# EAGLE design KGGR_MV (EAGLE 9.4.2)
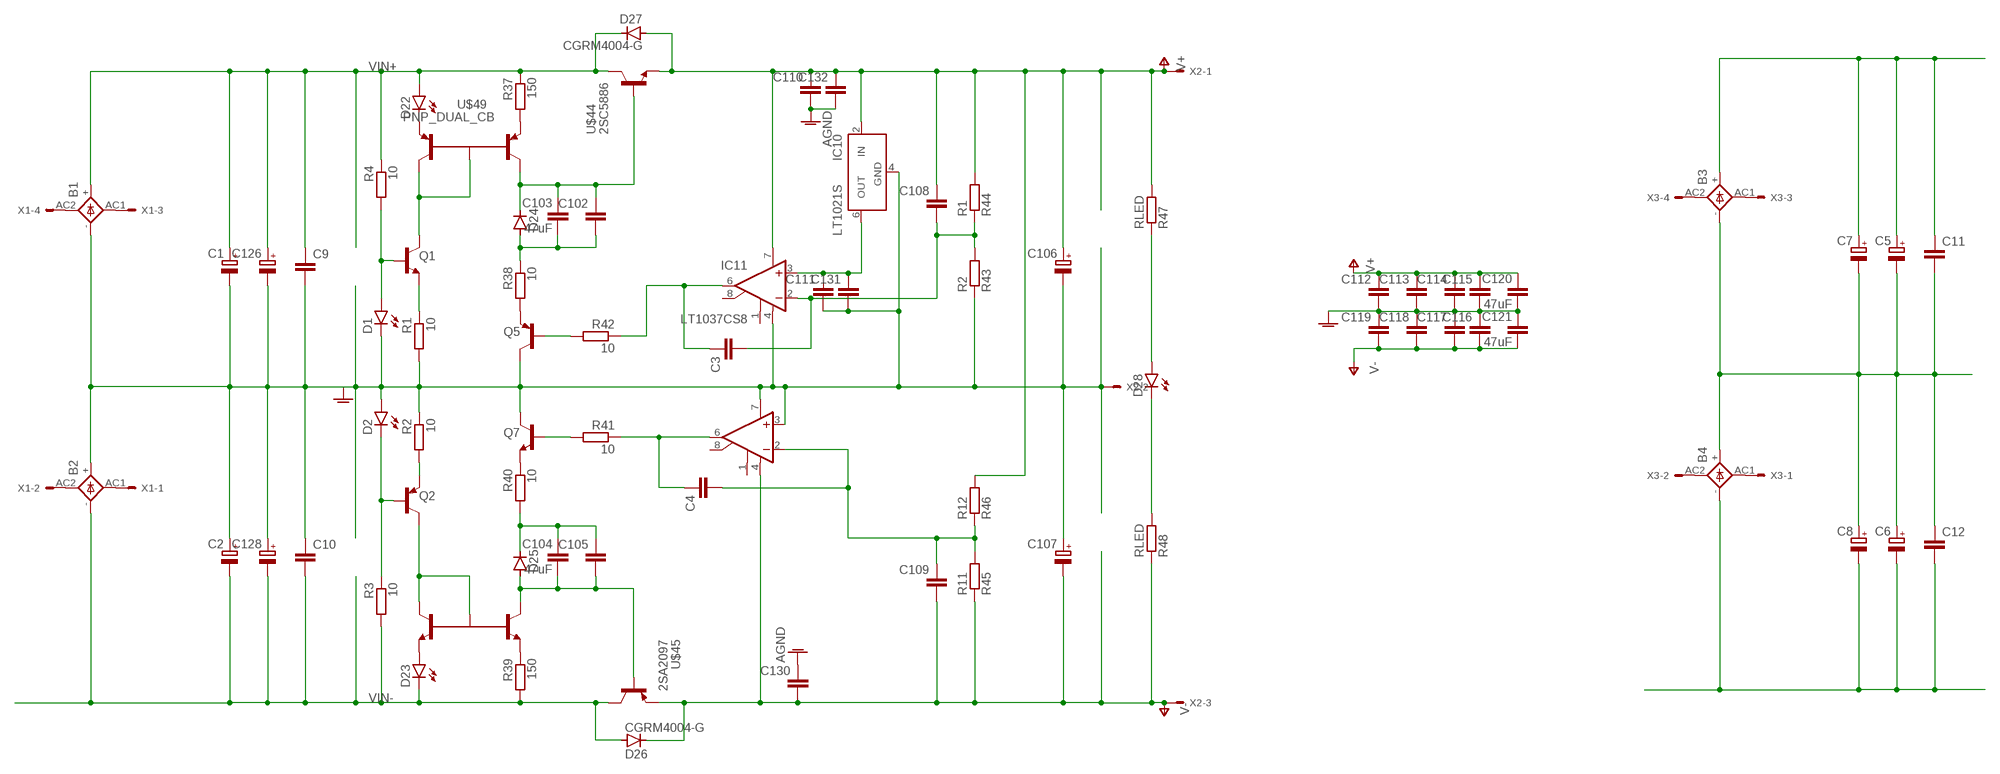
[diagram p0: schematic, sheet 1]

## Parts
B1  GBU4  [GBU4S]
B2  GBU4  [GBU4S]
B3  GBU4  [GBU4S]
B4  GBU4  [GBU4S]
C1  CPOL-EUE7.5-18  [E7,5-18]
C2  CPOL-EUE7.5-18  [E7,5-18]
C3  C-EUC0805  [C0805]
C4  C-EUC0805  [C0805]
C5  CPOL-EUE10-35  [EB35D]
C6  CPOL-EUE10-35  [EB35D]
C7  CPOL-EUE10-35  [EB35D]
C8  CPOL-EUE10-35  [EB35D]
C9  C-EU050-050X075  [C050-050X075]
C10  C-EU050-050X075  [C050-050X075]
C11  C-EU050-050X075  [C050-050X075]
C12  C-EU050-050X075  [C050-050X075]
C102  C-EUC0805  [C0805]
C103  47uF  C-EUC1206  [C1206]
C104  47uF  C-EUC1206  [C1206]
C105  C-EUC0805  [C0805]
C106  CPOL-EUE5-10.5  [E5-10,5]
C107  CPOL-EUE5-10.5  [E5-10,5]
C108  C-EUC0805  [C0805]
C109  C-EUC0805  [C0805]
C110  C-EUC0805  [C0805]
C111  C-EUC0805  [C0805]
C112  C-EUC0805  [C0805]
C113  C-EUC0805  [C0805]
C114  C-EUC0805  [C0805]
C115  C-EUC0805  [C0805]
C116  C-EUC0805  [C0805]
C117  C-EUC0805  [C0805]
C118  C-EUC0805  [C0805]
C119  C-EUC0805  [C0805]
C120  47uF  C-EUC1206  [C1206]
C121  47uF  C-EUC1206  [C1206]
C126  CPOL-EUE7.5-18  [E7,5-18]
C128  CPOL-EUE7.5-18  [E7,5-18]
C130  C-EUC0805  [C0805]
C131  C-EUC0805  [C0805]
C132  C-EUC0805  [C0805]
D1  LEDVWV1206  [LED_SML1206]
D2  LEDVWV1206  [LED_SML1206]
D22  LEDVWV1206  [LED_SML1206]
D23  LEDVWV1206  [LED_SML1206]
D24  TZMC10  DIODE-SOD80C  [SOD80C]
D25  TZAMC10  DIODE-SOD80C  [SOD80C]
D26  CGRM4004-G  [SOD-123_MINI-SMA]
D27  CGRM4004-G  [SOD-123_MINI-SMA]
D28  LEDVWV1206  [LED_SML1206]
IC10  LT1021S  [SOIC8]
IC11  LT1037CS8  [SOIC8]
IC12  LT1037CS8  [SOIC8]
Q1  TRANSISTOR_BC847CLT1-NPN-SOT23-BEC  [TRANSISTOR_SOT23-BEC]
Q2  TRANSISTOR_BC857C-PNP-SOT23-BEC  [TRANSISTOR_SOT23-BEC]
Q5  TRANSISTOR_BC857C-PNP-SOT23-BEC  [TRANSISTOR_SOT23-BEC]
Q7  TRANSISTOR_BC847CLT1-NPN-SOT23-BEC  [TRANSISTOR_SOT23-BEC]
R1  10  R-EU_MELF0204W  [MINI_MELF-0204W]
R2  10  R-EU_MELF0204W  [MINI_MELF-0204W]
R3  10  R-EU_MELF0204W  [MINI_MELF-0204W]
R4  10  R-EU_MELF0204W  [MINI_MELF-0204W]
R37  150  R-EU_MELF0204W  [MINI_MELF-0204W]
R38  10  R-EU_MELF0204W  [MINI_MELF-0204W]
R39  150  R-EU_MELF0204W  [MINI_MELF-0204W]
R40  10  R-EU_MELF0204W  [MINI_MELF-0204W]
R41  10  R-EU_MELF0204W  [MINI_MELF-0204W]
R42  10  R-EU_MELF0204W  [MINI_MELF-0204W]
R43  R2  R-EU_MELF0204W  [MINI_MELF-0204W]
R44  R1  R-EU_MELF0204W  [MINI_MELF-0204W]
R45  R11  R-EU_MELF0204W  [MINI_MELF-0204W]
R46  R12  R-EU_MELF0204W  [MINI_MELF-0204W]
R47  RLED  R-EU_MELF0204W  [MINI_MELF-0204W]
R48  RLED  R-EU_MELF0204W  [MINI_MELF-0204W]
U$44  2SC5886  [NEW-PWMOLD]
U$45  2SA2097  [NEW-PWMOLD]
U$48  NPN_DUAL_CBSOT-25-5  [SOT25]
U$49  PNP_DUAL_CB  [SOT25]
X1  KK-156-4  [KK-156-4]
X2  KK-156-3  [KK-156-3]
X3  KK-156-4  [KK-156-4]

## Nets
AGND: B1.- B2.+ C1.- C2.+ C9.2 C10.1 C106.- C107.+ C110.2 C111.2 C112.2 C113.2 C114.2 C115.2 C116.1 C117.1 C118.1 C119.1 C120.2 C121.1 C126.- C128.+ C130.1 C131.2 C132.2 D1.C D2.A IC10.4(GND) IC11.4(V-) IC12.3(+IN) IC12.7(V+) Q5.C Q7.C R1.2 R2.1 R43.1 X2.2
AGND1: B3.- B4.+ C5.- C6.+ C7.- C8.+ C11.2 C12.1
N$1: B1.AC2(AC1) X1.4
N$2: B1.AC1(AC2) X1.3
N$3: B2.AC2(AC1) X1.2
N$4: B2.AC1(AC2) X1.1
N$5: B3.AC2(AC1) X3.4
N$6: B3.AC1(AC2) X3.3
N$7: B4.AC2(AC1) X3.2
N$8: B4.AC1(AC2) X3.1
N$9: Q1.E R1.1
N$10: D1.A Q1.B R4.2
N$12: Q2.E R2.2
N$13: D2.C Q2.B R3.1
N$96: Q1.C U$49.2(B) U$49.5(C1)
N$97: C102.1 C103.1 D24.C U$44.1(B) U$49.4(C2)
N$98: C102.2 C103.2 D24.A R38.1
N$99: Q5.E R38.2
N$100: Q7.E R40.1
N$101: C104.1 C105.1 D25.C R40.2
N$102: C104.2 C105.2 D25.A U$45.1(B) U$48.4(C2)
N$103: Q2.C U$48.2(B) U$48.5(C1)
N$104: Q7.B R41.2
N$105: Q5.B R42.2
N$106: C3.2 C108.2 IC11.2(-IN) R43.2 R44.1
N$107: D28.C R48.2
N$108: D28.A R47.1
N$109: C4.1 IC12.6(OUT) R41.1
N$110: C4.2 C109.1 IC12.2(-IN) R45.2 R46.1
N$111: C111.1 C131.1 IC10.6(OUT) IC11.3(+IN)
N$112: C3.1 IC11.6(OUT) R42.1
N$113: R39.1 U$48.3(E2)
N$114: D23.A U$48.1(E1)
N$115: R37.2 U$49.3(E2)
N$116: D22.C U$49.1(E1)
V+: C106.+ C108.1 C110.1 C112.1 C113.1 C114.1 C115.1 C120.1 C132.1 D27.A IC10.2(IN) IC11.7(V+) R44.2 R46.2 R47.2 U$44.3(E) X2.1
V-: C107.- C109.2 C116.2 C117.2 C118.2 C119.2 C121.2 C130.2 D26.C IC12.4(V-) R45.1 R48.1 U$45.3(E) X2.3
VIN+: B1.+ C1.+ C9.1 C126.+ D22.A D27.C R4.1 R37.1 U$44.2(C) U$44.4(C) U$44.P$1(C) U$44.P$2(C) U$44.P$3(C) U$44.P$4(C) U$44.P$5(C) U$44.P$6(C) U$44.P$7(C) U$44.P$8(C) U$44.P$9(C) U$44.P$10(C) U$44.P$11(C) U$44.P$12(C) U$44.P$13(C) U$44.P$14(C) U$44.P$15(C) U$44.P$16(C) U$44.P$17(C) U$44.P$18(C) U$44.P$19(C) U$44.P$20(C) U$44.P$21(C) U$44.P$22(C) U$44.P$23(C) U$44.P$24(C) U$44.P$25(C) U$44.P$26(C) U$44.P$27(C) U$44.P$28(C) U$44.P$29(C) U$44.P$30(C) U$44.P$31(C) U$44.P$32(C) U$44.P$33(C) U$44.P$34(C) U$44.P$35(C) U$44.P$36(C) U$44.P$37(C) U$44.P$38(C) U$44.P$39(C) U$44.P$40(C) U$44.P$41(C) U$44.P$42(C) U$44.P$43(C) U$44.P$44(C) U$44.P$45(C) U$44.P$46(C) U$44.P$47(C) U$44.P$48(C) U$44.P$49(C) U$44.P$50(C) U$44.P$51(C) U$44.P$52(C) U$44.P$53(C) U$44.P$54(C) U$44.P$55(C) U$44.P$56(C) U$44.P$57(C) U$44.P$58(C) U$44.P$59(C) U$44.P$60(C) U$44.P$61(C) U$44.P$62(C) U$44.P$63(C)
VIN+1: B3.+ C5.+ C7.+ C11.1
VIN-: B2.- C2.- C10.2 C128.- D23.C D26.A R3.2 R39.2 U$45.2(C) U$45.4(C) U$45.P$1(C) U$45.P$2(C) U$45.P$3(C) U$45.P$4(C) U$45.P$5(C) U$45.P$6(C) U$45.P$7(C) U$45.P$8(C) U$45.P$9(C) U$45.P$10(C) U$45.P$11(C) U$45.P$12(C) U$45.P$13(C) U$45.P$14(C) U$45.P$15(C) U$45.P$16(C) U$45.P$17(C) U$45.P$18(C) U$45.P$19(C) U$45.P$20(C) U$45.P$21(C) U$45.P$22(C) U$45.P$23(C) U$45.P$24(C) U$45.P$25(C) U$45.P$26(C) U$45.P$27(C) U$45.P$28(C) U$45.P$29(C) U$45.P$30(C) U$45.P$31(C) U$45.P$32(C) U$45.P$33(C) U$45.P$34(C) U$45.P$35(C) U$45.P$36(C) U$45.P$37(C) U$45.P$38(C) U$45.P$39(C) U$45.P$40(C) U$45.P$41(C) U$45.P$42(C) U$45.P$43(C) U$45.P$44(C) U$45.P$45(C) U$45.P$46(C) U$45.P$47(C) U$45.P$48(C) U$45.P$49(C) U$45.P$50(C) U$45.P$51(C) U$45.P$52(C) U$45.P$53(C) U$45.P$54(C) U$45.P$55(C) U$45.P$56(C) U$45.P$57(C) U$45.P$58(C) U$45.P$59(C) U$45.P$60(C) U$45.P$61(C) U$45.P$62(C) U$45.P$63(C)
VIN-1: B4.- C6.- C8.- C12.2
Unconnected: IC11.1(CMP1) IC11.8(CMP2) IC12.1(CMP1) IC12.8(CMP2)

## Library data of the parts
B1-B4 = Vwvwbg:GBU4: GENERAL INSTRUMENT RECTIFIER
C1 C2 C5-C8 C106 C107 C126 C128 = Vwvwbg:CPOL-EU: POLARIZED CAPACITOR, European symbol
C3 C4 C9-C12 C102-C105 C108-C121 C130-C132 = Vwvwbg:C-EU: CAPACITOR, European symbol
D1 D2 D22 D23 D28 = Vwvwbg:LED: LED OSRAM: - CHIPLED LG R971, LG N971, LY N971, LG Q971, LY Q971, LO R971, LY R971 LH N974, LH R974 LS Q976, LO Q976, LY Q976 LO Q996 - Hyper CHIPLED LW Q18S LB Q993, LB Q99A, LB R99A - SideLED LS A670, LO A670, LY A670, LG A670, LP A670 LB A673, LV A673, LT A673, LW A673 LH A674 LY A675 LS A676, LA A676, LO A676, LY A676, LW A676 LS A679, LY A679, LG A679 - Hyper Micro SIDELED® LS Y876, LA Y876, LO Y876, LY Y876 LT Y87S - SmartLED LW L88C, LW L88S LB L89C, LB L89S, LG L890 LS L89K, LO L89K, LY L89K LS L896, LA L896, LO L896, LY L896 - TOPLED LS T670, LO T670, LY T670, LG T670, LP T670 LSG T670, LSP T670, LSY T670, LOP T670, LYG T670 LG T671, LOG T671, LSG T671 LB T673, LV T673, LT T673, LW T673 LH T674 LS T676, LA T676, LO T676, LY T676, LB T676, LH T676, LSB T676, LW T676 LB T67C, LV T67C, LT T67C, LS T67K, LO T67K, LY T67K, LW E67C LS E67B, LA E67B, LO E67B, LY E67B, LB E67C, LV E67C, LT E67C LW T67C LS T679, LY T679, LG T679 LS T770, LO T770, LY T770, LG T770, LP T770 LB T773, LV T773, LT T773, LW T773 LH T774 LS E675, LA E675, LY E675, LS T675 LS T776, LA T776, LO T776, LY T776, LB T776 LHGB T686 LT T68C, LB T68C - Hyper Mini TOPLED® LB M676 - Mini TOPLED Santana® LG M470 LS M47K, LO M47K, LY M47K Source: http://www.osram.convergy.de LUXEON: - LUMILED® LXK2-PW12-R00, LXK2-PW12-S00, LXK2-PW14-U00, LXK2-PW14-V00 LXK2-PM12-R00, LXK2-PM12-S00, LXK2-PM14-U00 LXK2-PE12-Q00, LXK2-PE12-R00, LXK2-PE12-S00, LXK2-PE14-T00, LXK2-PE14-U00 LXK2-PB12-K00, LXK2-PB12-L00, LXK2-PB12-M00, LXK2-PB14-N00, LXK2-PB14-P00, LXK2-PB14-Q00 LXK2-PR12-L00, LXK2-PR12-M00, LXK2-PR14-Q00, LXK2-PR14-R00 LXK2-PD12-Q00, LXK2-PD12-R00, LXK2-PD12-S00 LXK2-PH12-R00, LXK2-PH12-S00 LXK2-PL12-P00, LXK2-PL12-Q00, LXK2-PL12-R00 Source: www.luxeon.com KINGBRIGHT: KA-3528ASYC Source: www.kingbright.com
D24 D25 = Vwvwbg:DIODE-: DIODE
D26 D27 = diode:CGRM400*-G: Molded plasitc,JEDEC SOD-123/Mini SMA Source: Comchip CGRM4001-G.pdf
IC10 = Vwvwbg:LT1021: Precision Reference Source: http://www.linear.com/pc/downloadDocument.do?navId=H0,C1,C1010,C1603,P1229,D2805; MPN: LT1021DCS8-10#PBF; OC_FARNELL: 1273428; OC_NEWARK: 57M0993
IC11 IC12 = Vwvwbg:LT10*: Low Noise, High Speed, Precision Operational Amplifiers Source: http://www.linear.com/pc/downloadDocument.do?navId=H0,C1,C1154,C1009,C1026,P1212,D2204
Q1 Q7 = Vwvwbg:TRANSISTOR_*-NPN-: NPN Transistror BF959 corrected 2008.03.06
Q2 Q5 = Vwvwbg:TRANSISTOR_*-PNP-: PNP Transistror
R1-R4 R37-R48 = Vwvwbg:R-EU_: RESISTOR, European symbol
U$44 = Vwvwbg:2SC5886
U$45 = Vwvwbg:2SA2097
U$48 = Vwvwbg:NPN_DUAL_CB
U$49 = Vwvwbg:PNP_DUAL_CB
X1 X3 = Vwvwbg:KK-156-4: KK 156 HEADER Source: http://www.molex.com/pdm_docs/sd/026604100_sd.pdf; MF: MOLEX; OC_FARNELL: unknown; OC_NEWARK: unknown
X2 = Vwvwbg:KK-156-3: KK 156 HEADER Source: http://www.molex.com/pdm_docs/sd/026604100_sd.pdf; MF: MOLEX; OC_FARNELL: unknown; OC_NEWARK: unknown

## Board
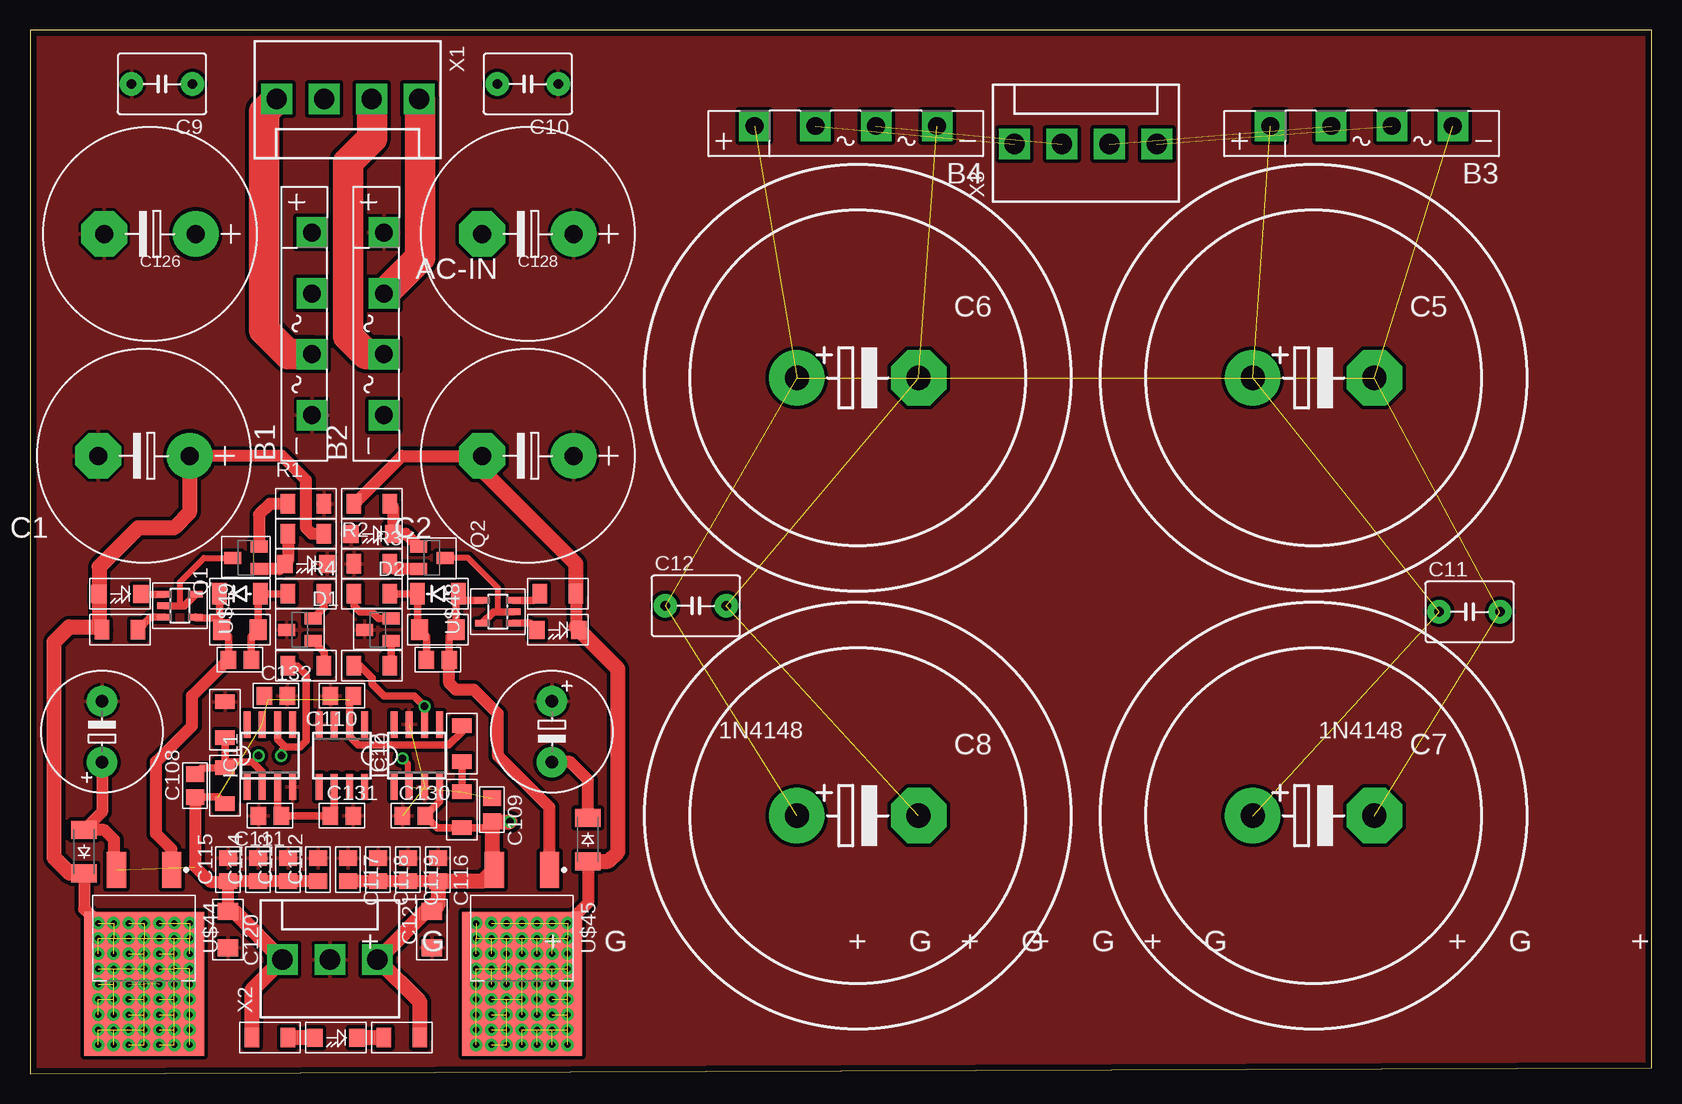
[diagram p1: board, top side]
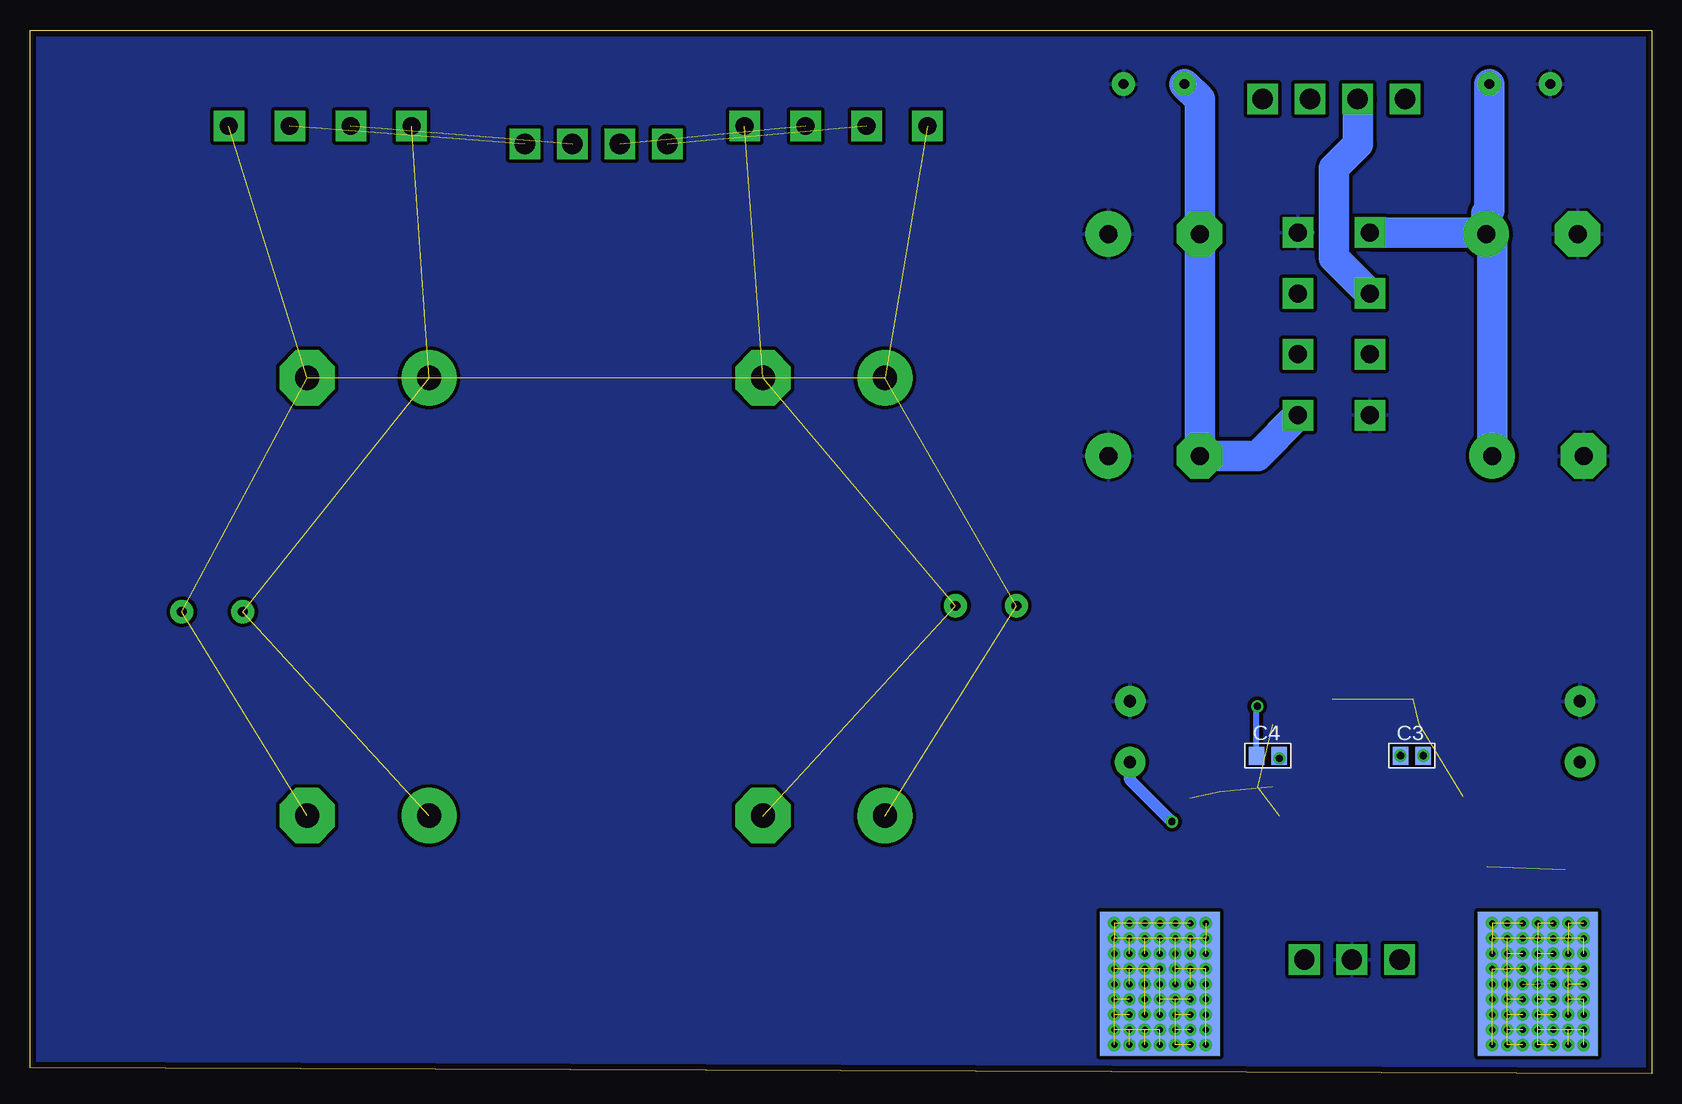
[diagram p2: board, bottom side, seen from below]

Size 135.19 x 87 mm. Coordinates in mm from the lower left corner, seen from the top.
Outline: 0,0 135.19,0.5 135.19,87 0,87 0,0
Copper layers (1*16): Top 0.035mm / dielectric 1.5mm / Bottom 0.035mm
Design rules "default *": minimum track width 10mil, minimum drill 24mil, track to track 12mil, track to pad 12mil, pad to pad 8mil, via to via 8mil, smd to smd 8mil, copper to edge 20mil, drill to drill 8mil, minimum pad ring 10mil, minimum via ring 8mil, stop-mask expansion 4mil, vias tented up to drill 0mil, thermal gap 10mil

### Footprints (pad centres in the part's own frame; a part is rotated, then mirrored left to right if it is on the bottom)
GBU4S = drill 1.499 pad 2.54 square: + 7.62,0; - -7.62,0; AC1 2.54,0; AC2 -2.54,0
E7,5-18 = drill 1.5 pad 3.81: + -3.81,0 | drill 1.5 pad 3.81 octagon: - 3.81,0
C0805 = smd 1.3 x 1.5: 1 -0.95,0; 2 0.95,0
EB35D = drill 2.007 pad 4.597: + -5.08,0 | drill 2.007 pad 4.597 octagon: - 5.08,0
C050-050X075 = drill 0.813 pad 1.93: 1 -2.54,0; 2 2.54,0
C1206 = smd 1.4 x 1.7: 1 -1.527,0; 2 1.527,0
E5-10,5 = drill 1.016 pad 2.54: + -2.54,0; - 2.54,0
LED_SML1206 = smd 1.3 x 1.5: A 1.75,0; C -1.75,0
SOD80C = smd 1.2 x 1.8: A 1.7,0; C -1.7,0
SOD-123_MINI-SMA = smd 1.5 x 2.1: A 1.8,0; C -1.8,0
SOIC8 = smd 0.6 x 2.2: 1 -1.905,-2.6; 2 -0.635,-2.6; 3 0.635,-2.6; 4 1.905,-2.6; 5 1.905,2.6; 6 0.635,2.6; 7 -0.635,2.6; 8 -1.905,2.6
TRANSISTOR_SOT23-BEC = smd 1 x 1.4: B -0.95,-1.1; C 0,1.1; E 0.95,-1.1
MINI_MELF-0204W = smd 1.2 x 1.6: 1 -1.5,0; 2 1.5,0
NEW-PWMOLD = smd 3 x 1.6: 1 0.003,2.3; 3 0.003,-2.3 | smd 12 x 10 bottom: 2 9.5,0 | smd 12 x 10: 4 9.5,0 | drill 0.5 pad 1.016: P$1 5.734,2.54; P$2 7.004,2.54; P$3 8.274,2.54; P$4 9.544,2.54; P$5 10.814,2.54; P$6 12.084,2.54; P$7 13.354,2.54; P$8 13.354,1.27; P$9 12.084,1.27; P$10 9.544,1.27; P$11 10.814,1.27; P$12 8.274,1.27; P$13 7.004,1.27; P$14 5.734,1.27; P$15 5.734,0; P$16 7.004,0; P$17 8.274,0; P$18 9.544,0; P$19 10.814,0; P$20 12.084,0; P$21 13.354,0; P$22 13.354,-1.27; P$23 12.084,-1.27; P$24 10.814,-1.27; P$25 9.544,-1.27; P$26 8.274,-1.27; P$27 7.004,-1.27; P$28 5.734,-1.27; P$29 5.734,-2.54; P$30 7.004,-2.54; P$31 8.274,-2.54; P$32 9.544,-2.54; P$33 10.814,-2.54; P$34 12.084,-2.54; P$35 13.354,-2.54; P$36 13.354,-3.81; P$37 12.084,-3.81; P$38 10.814,-3.81; P$39 9.544,-3.81; P$40 7.004,-3.81; P$41 5.734,-3.81; P$42 8.274,-3.81; P$43 5.734,3.81; P$44 7.004,3.81; P$45 8.274,3.81; P$46 9.544,3.81; P$47 10.814,3.81; P$48 12.084,3.81; P$49 13.354,3.81; P$50 14.624,3.81; P$51 14.624,2.54; P$52 14.624,1.27; P$53 14.624,0; P$54 14.624,-1.27; P$55 14.624,-2.54; P$56 14.624,-3.81; P$57 4.464,3.81; P$58 4.464,2.54; P$59 4.464,1.27; P$60 4.464,0; P$61 4.464,-1.27; P$62 4.464,-2.54; P$63 4.464,-3.81
SOT25 = smd 0.55 x 1.2: 1 -0.95,-1.3; 2 0,-1.3; 3 0.95,-1.3; 4 0.95,1.3; 5 -0.95,1.3
KK-156-4 = drill 1.7 pad 2.54 square: 1 -5.94,0; 2 -1.98,0; 3 1.98,0; 4 5.94,0
KK-156-3 = drill 1.7 pad 2.54 square: 1 -3.96,0; 2 0,0; 3 3.96,0

### Placement (x,y rotation side)
B1  23.5,62.5 90 top
B2  29.5,62.5 90 top
B3  111,79 180 top
B4  68,79 180 top
C1  9.5,51.5 180 top
C2  41.5,51.5 180 top
C3  20,26.5 0 bottom
C4  32,26.5 0 bottom
C5  107,58 0 top
C6  69,58 0 top
C7  107,21.5 0 top
C8  69,21.5 0 top
C9  11,82.5 180 top
C10  41.5,82.5 180 top
C11  120,38.5 0 top
C12  55.5,39 0 top
C102  17.5,34.5 0 top
C103  17.5,37 0 top
C104  34,37 0 top
C105  34,34.5 0 top
C106  6,28.5 90 top
C107  43.5,28.5 270 top
C108  13.75,24 90 top
C109  38.5,22 270 top
C110  26,31.5 180 top
C111  20,21.5 180 top
C112  24,17 90 top
C113  21.5,17 90 top
C114  19,17 90 top
C115  16.5,17 90 top
C116  34,17 270 top
C117  26.5,17 270 top
C118  29,17 270 top
C119  31.5,17 270 top
C120  16.5,12 270 top
C121  33.5,12 90 top
C126  10,70 180 top
C128  41.5,70 180 top
C130  32,21.5 0 top
C131  26,21.5 0 top
C132  20.5,31.5 0 top
D1  23,42.5 180 top
D2  28.5,45 180 top
D22  7.5,40 180 top
D23  44,37 180 top
D24  17.5,40 0 top
D25  34,40 0 top
D26  46.5,19.5 270 top
D27  4.5,18.5 90 top
D28  25.5,3 180 top
IC10  26,26.5 180 top
IC11  20,26.5 0 top
IC12  32.25,26.5 0 top
Q1  18,43 90 top
Q2  33.5,43 270 top
Q5  22.5,37 90 top
Q7  29,37 90 top
R1  23,47.5 0 top
R2  28.5,42.5 0 top
R3  28.5,47.5 180 top
R4  23,45 180 top
R37  7.5,37 0 top
R38  23,40 0 top
R39  44,40 0 top
R40  28.5,40 0 top
R41  28.5,34 0 top
R42  23,34 0 top
R43  16.25,29.5 270 top
R44  16.25,24 270 top
R45  36,22 90 top
R46  36,27.5 90 top
R47  20,3 180 top
R48  31,3 180 top
U$44  9.5,17 270 top
U$45  41,17 270 top
U$48  39,38.5 90 top
U$49  12.5,39 270 top
X1  26.5,81.25 180 top
X2  25,9.5 0 top
X3  88,77.5 0 top

### Tracks (layer width: path | path; a pad name or v marks a point on that pad's centre or on a via)
AGND  (2 unrouted)
  pour Top: -3,106.68 152.88,106.68 152.88,-1.27 -3,-1.27
  pour Bottom: -2.5,-1.27 -2.5,106.18 152.88,106.18 152.88,-1.27
AGND1  (7 unrouted)
N$1
  Top 2.54: B1.AC2 23.46,60 21.5,60 19.5,62 19.5,80.19 X1.4
N$2
  Bottom 2.54: B1.AC1 26.5,68.04 26.5,75.5 24.5,77.5 24.5,81.23 X1.3
N$3
  Top 2.54: B2.AC2 28.04,59.96 26.5,61.5 26.5,76 28.5,78 28.5,81.23 X1.2
N$4
  Top 2.54: B2.AC1 32.5,68.04 32.5,81.19 X1.1
N$5  (1 unrouted)
N$6  (1 unrouted)
N$7  (1 unrouted)
N$8  (1 unrouted)
N$9
  Top 1.016: R1.1 20,47.5 19.1,46.6 Q1.E
N$10
  Top 1.016: R4.2 21.5,42.75 D1.A 20.8,42.05 Q1.B
N$12
  Top 1.016: Q2.E 30.45,42.05 R2.2
N$13
  Top 1.016: R3.1 30.25,47.25 D2.C 31.35,45 Q2.B
N$96
  Top 0.508: 12.5,39 12.5,41 14.5,43 Q1.C
  Top 0.61: U$49.5 12.85,39 12.5,39 U$49.2
N$97
  Top 0.61: C102.1 16.55,36.42 C103.1 15.8,37.17 15.8,38 | D24.C 15.8,38 | U$49.4 13.85,38 15.8,38
  Top 1.016: U$44.1 11.8,18.7 10.5,20 10.5,26 13.5,29 13.5,31.5 16.5,34.5 C102.1
N$98
  Top 0.61: R38.1 D24.A 19.03,39.83 C103.2 18.45,36.42 C102.2
N$99
  Top 0.61: R38.2 24.5,38.85 Q5.E
N$100
  Top 0.61: Q7.E 29.05,37.95 28.5,38.5 27.5,38.5 27,39 R40.1
N$101
  Top 0.61: R40.2 D25.C 32.3,37.17 C104.1 33.05,36.42 C105.1
N$102
  Top 0.61: C105.2 34.95,36.42 C104.2 35.53,39.83 D25.A 36.25,39.45 U$48.4
  Top 1.016: C105.2 34.95,32.55 35.5,32 37,32 39,30 39,26.5 43.3,22.2 U$45.1
N$103
  Top 0.508: 39,38.5 39,40.5 36.5,43 Q2.C
  Top 0.61: U$48.5 38.65,38.5 39,38.5 U$48.2
N$104
  Top 0.61: Q7.B 30.1,34.1 R41.2
N$105
  Top 0.61: Q5.B 24.5,35.15 R42.2
N$106  (via drill 0.61)
  Top 0.508: C3.2 18.55,26 18.5,26
  Top 0.61: 16.25,26 R44.1 14.3,25.5 C108.2 | 16.25,26 R43.2 | IC11.2 19.36,25.14 18.5,26 16.25,26
  other vias: 19.05,26.5
N$107
  Top 1.27: R48.2 D28.C
N$108
  Top 1.27: D28.A R47.1
N$109  (via drill 0.61)
  Top 0.508: IC12.6 v32.89,30.61
  Top 0.61: v32.89,30.61 32,31.5 29.5,31.5 28.5,32.5 28.5,33 27.5,34 R41.1
  Bottom 0.508: C4.1 32.95,30.55 v32.89,30.61
N$110  (via drill 0.61)  (2 unrouted)
  Top 0.508: IC12.2 31.5,24.02 31.5,25.82 v31.05,26.27
  Top 0.61: R46.1 R45.2
  Bottom 0.508: v31.05,26.27 C4.2
N$111
  Top 0.61: IC11.3 20.64,21.82 C111.1 C131.1 25.36,21.82 IC10.6
N$112  (via drill 0.61)
  Top 0.508: 21.25,27.25 20.95,26.95 C3.1
  Top 0.61: IC11.6 20.64,27.86 21.25,27.25 22.5,27.25 23,27.75 23,33.25 22.25,34 R42.1
  other vias: 20.95,26.5
N$113
  Top 0.61: U$48.3 41.95,39.45 R39.1
N$114
  Top 0.61: U$48.1 41.7,37.55 D23.A
N$115
  Top 0.61: U$49.3 10.05,38.05 R37.2
N$116
  Top 0.61: U$49.1 9.3,39.95 D22.C
V+  (4 unrouted)
  Top 0.61: C110.1 26.64,31.18 IC10.2 26.64,28.11 27.35,27.39 34.89,27.39 36,28.5 R46.2 | 19.86,31.18 C132.1 | C108.1 15.7,23.05 R44.2
  Top 1.016: C108.1 13.75,17.25 15,16 16.45,16 | 16.45,16 C115.1 C114.1 C113.1 C112.1 | C120.1 16.5,15.95 16.45,16 | U$44.3 7,17.2 7,19.5 6.2,20.3 D27.A 6,21.8 C106.+
  Top 1.27: C120.1 17.01,13.53 X2.1 18.5,6.96 R47.2
V-  (via drill 0.61)
  Top 0.61: IC12.4 34.16,22.7 C130.2 33.95,20.5 R45.1 37.95,20.5 C109.2
  Top 1.016: 27.5,16 27.45,16.05 C117.2 C118.2 C119.2 C116.2 | D26.C 46.5,24.5 45.04,25.96 C107.-
  Top 1.27: 34,14.03 C116.2 37.75,16.05 U$45.3 38.5,17.2 C109.2 38.55,21 v40,21 | 34,14.03 C121.2 | 34,14.03 33.49,14.03 X2.3 32.5,5.96 R48.1
  Bottom 1.016: v40,21 43.5,24.5 C107.-
VIN+  (64 unrouted)
  Top 1.016: D27.C 4.5,13.73 U$44.P$63 | R4.1 23.5,45 23,45.5 23,49.5 21,51.5 C1.+
  Top 1.27: C1.+ 13.31,46.81 12,45.5 9,45.5 5.75,42.25 D22.A 5.75,37.25 | 5.75,37.25 R37.1 | D27.C 3.3,16.7 2,18 2,36 3.25,37.25 5.75,37.25
  Bottom 2.54: B1.+ 13.93,70.12 C126.+ | C126.+ 13.31,69.5 C1.+ | C9.1 13.54,71.96 13.81,71.69 C126.+
VIN+1  (3 unrouted)
VIN-  (64 unrouted)
  Top 1.016: D26.A 46.5,14.23 U$45.P$57 | R39.2 45.5,37.25 D23.C | R3.2 31,51.5 C2.-
  Top 1.27: R39.2 45.5,42.5 37.69,50.31 C2.- | D26.A 48.2,17.7 49,18.5 49,33.75 45.5,37.25
  Bottom 2.54: B2.- 32.88,51.5 C2.- C128.- 37.69,81.23 C10.2
VIN-1  (3 unrouted)

### Text on the board
tPlace: AC-IN
tNames: 1N4148 | 1N4148 | 1N4148 | + | G | + | G | + | G | + | G | + | G | + | G | + | G | + | G | + | G | + | G | + | G | + | G